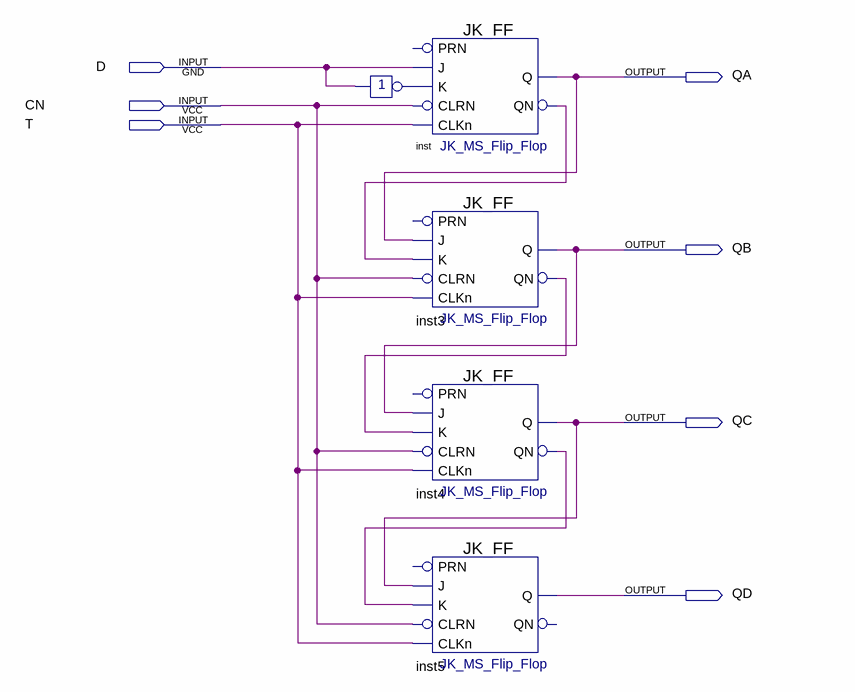
[diagram p0: schematic sheet]
// Quartus schematic 4SR.bdf as structural Verilog: 5 symbols, 7 pins
module \4SR  (
  input  D,
  input  CN,
  input  T,
  output QA,
  output QB,
  output QC,
  output QD
);

  wire inst2_out, inst3_qn, inst4_qn, inst_qn;

  JK_FF inst (.K(inst2_out), .J(D), .CLRN(CN), .CLKn(T), .QN(inst_qn), .Q(QA));  // open: PRN
  not inst2 (inst2_out, D);
  JK_FF inst3 (.K(inst_qn), .J(QA), .CLRN(CN), .CLKn(T), .QN(inst3_qn), .Q(QB));  // open: PRN
  JK_FF inst4 (.K(inst3_qn), .J(QB), .CLRN(CN), .CLKn(T), .QN(inst4_qn), .Q(QC));  // open: PRN
  JK_FF inst5 (.K(inst4_qn), .J(QC), .CLRN(CN), .CLKn(T), .Q(QD));  // open: PRN, QN
endmodule
